# Altium project Logger.PrjPcb
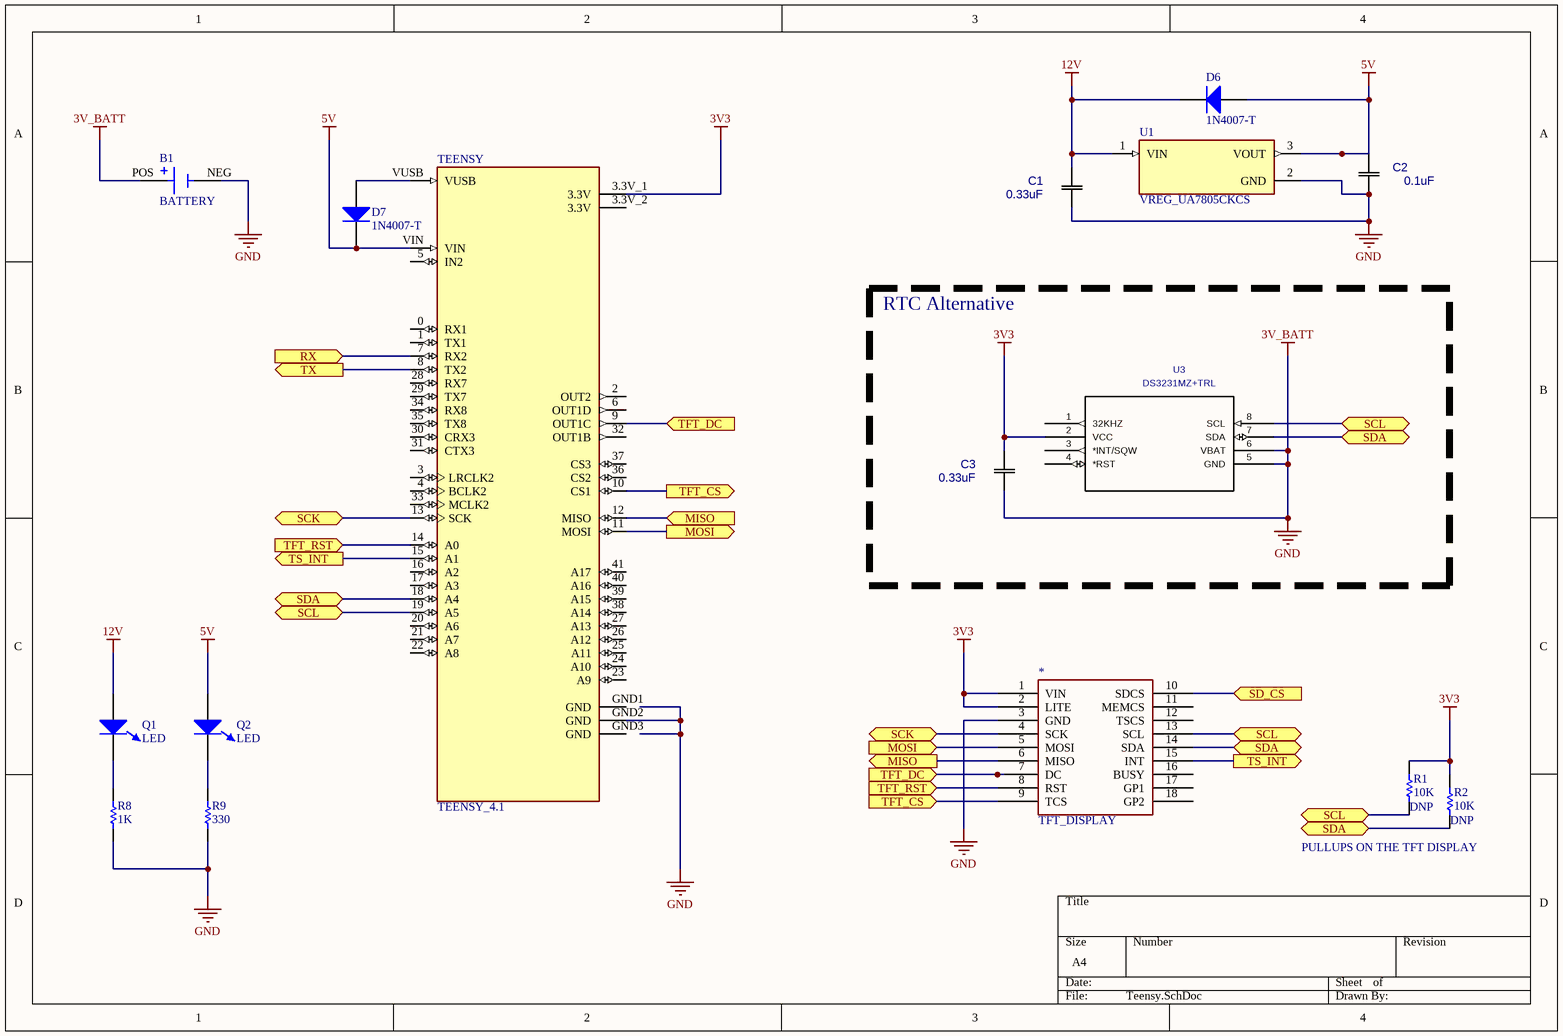
[diagram p0: Teensy.SchDoc]
3 sheets, 44 parts. Net scope: flat (ports and power ports of the same name join across sheets).
Sheets:
  Teensy.SchDoc
  LIN.SchDoc
  Pico.SchDoc

## Sheet Teensy.SchDoc
size A4

### Parts
(Parts that share a designator on the sheet are numbered #1, #2 ... from top to bottom, then left to right.)
*#1  TFT_DISPLAY
B1#1  BATTERY
C1#1  value 0.33uF  [CAP_TH_CER_5MM]  (hidden comment: CAP_TH_CER)
C2#1  value 0.1uF  [CAP_TH_CER_5MM]  (hidden comment: CAP_TH_CER)
C3#1  value 0.33uF  [CAP_TH_CER_5MM]  (hidden comment: CAP_TH_CER)
D6  1N4007-T
D7  1N4007-T
Q1#1  LED  [DIODE_0603]
Q2#1  LED  [DIODE_0603]
R1#1  10K  NOTE: DNP
R2#1  10K  NOTE: DNP
R8#1  1K
R9#1  330
TEENSY  TEENSY_4.1  [TEENSY_4.1]
U1#1  VREG_UA7805CKCS  [TO-220-3_7805]
U3#1  DS3231MZ+TRL  [8-SOIC-3.90MM]

### Blocks framed on the sheet
RTC Alternative: C3#1 U3#1

### Ports
MISO, MOSI, RX, SCK, SCL, SD_CS, SDA, TFT_CS, TFT_DC, TFT_RST, TS_INT, TX

### Nets
3V3: *#1.1(VIN) *#1.2(LITE) C3#1.2 R1#1.2 R2#1.2 TEENSY.3.3V_1(3.3V) U3#1.2(VCC)
3V_BATT: *#1.3(GND) B1#1.NEG B1#1.POS C1#1.1 C2#1.1 C3#1.1 R8#1.1 R9#1.1 TEENSY.GND2(GND) U1#1.2(GND) U3#1.5(GND) U3#1.6(VBAT)  [also labelled GND]
5V: C2#1.2 D6.1(A) D7.2(K) Q2#1.1(A) TEENSY.VIN U1#1.3(VOUT)
12V: C1#1.2 D6.2(K) Q1#1.1(A) U1#1.1(VIN)
MISO: *#1.6(MISO) TEENSY.12(MISO) ; port MISO
MOSI: *#1.5(MOSI) TEENSY.11(MOSI) ; port MOSI
RX: TEENSY.7(RX2) ; port RX
SCK: *#1.4(SCK) TEENSY.13(SCK) ; port SCK
SCL: *#1.13(SCL) R1#1.1 TEENSY.19(A5) U3#1.8(SCL) ; port SCL
SD_CS: *#1.10(SDCS) ; port SD_CS
SDA: *#1.14(SDA) R2#1.1 TEENSY.18(A4) U3#1.7(SDA) ; port SDA
TFT_CS: *#1.9(TCS) TEENSY.10(CS1) ; port TFT_CS
TFT_DC: *#1.7(DC) TEENSY.9(OUT1C) ; port TFT_DC
TFT_RST: *#1.8(RST) TEENSY.14(A0) ; port TFT_RST
TS_INT: *#1.15(INT) TEENSY.15(A1) ; port TS_INT
TX: TEENSY.8(TX2) ; port TX
NetD7_1: D7.1(A) TEENSY.VUSB
NetQ1#1_2: Q1#1.2(K) R8#1.2
NetQ2#1_2: Q2#1.2(K) R9#1.2

Not connected (* = marked no-connect by the designer): *#1 11(MEMCS) 12(TSCS) 16(BUSY) 17(GP1) 18(GP2); TEENSY 0(RX1) 1(TX1) 2(OUT2) 3(LRCLK2) 3.3V_2(3.3V) 4(BCLK2) 5(IN2) 6(OUT1D) 16(A2) 17(A3) 20(A6) 21(A7) 22(A8) 23(A9) 24(A10) 25(A11) 26(A12) 27(A13) 28(RX7) 29(TX7) 30(CRX3) 31(CTX3) 32(OUT1B) 33(MCLK2) 34(RX8) 35(TX8) 36(CS2) 37(CS3) 38(A14) 39(A15) 40(A16) 41(A17) GND1(GND) GND3(GND); U3#1 1(32KHZ) 3(*INT/SQW) 4(*RST)

### Notes on the sheet
- PULLUPS ON THE TFT DISPLAY

### Library data of the parts
*#1 = EYESPI_TFT_BREAKOUT
B1#1 = BATTERY: MPN: 1060TR
C1#1 C2#1 C3#1 = CAP_TH_CER: Mfr_Name: TDK
D6 D7 = DIODE
Q1#1 Q2#1 = DIODE_LED
R1#1 R2#1 R8#1 R9#1 = RES: Resistor; Value: ? Ohms; MPN: ?; SuppliersPartNumber: ?; Power: ?
TEENSY = TEENSY_4.1: TEENSY 4.1
U1#1 = VREG_UA7805CKCS: 1.5-A, 38-V, linear voltage regulator; Price: None; MP: UA7805CKCS; Value: *; Availability: Unavailable; Package: None
U3#1 = IC_RTC_DS3231MZ+TRL: Mfr_Name: Analog Devices Inc; Value: DS3231MZ+TRL; Manufacturer_Part_Number: DS3231MZ+TRL

## Sheet LIN.SchDoc
size A4
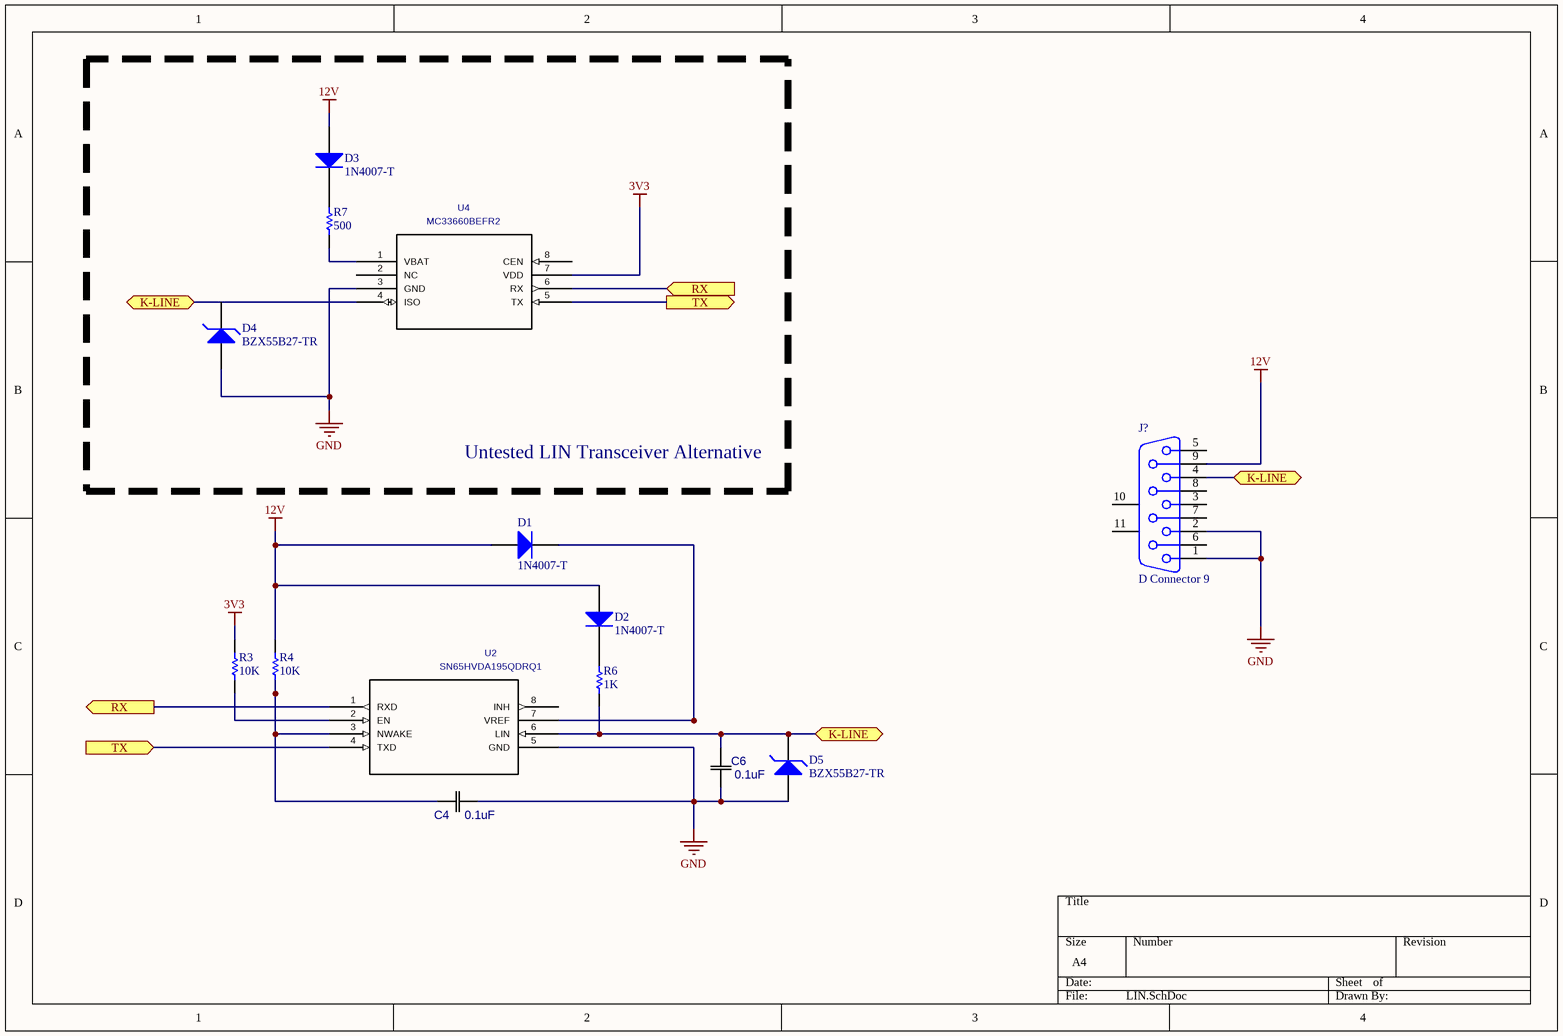
[diagram p1: LIN.SchDoc]

### Parts
C4  value 0.1uF  [CAP_TH_CER_5MM]  (hidden comment: CAP_TH_CER)
C6  value 0.1uF  [CAP_TH_CER_5MM]  (hidden comment: CAP_TH_CER)
D1  1N4007-T
D2  1N4007-T
D3  1N4007-T
D4  BZX55B27-TR
D5  BZX55B27-TR
J?  D Connector 9  [DSUB1.385-2H9]
R3  10K
R4  10K
R6  1K
R7  500
U2  SN65HVDA195QDRQ1  [8-Pin SOIC]
U4  MC33660BEFR2  [8-SOIC-3.90MM]

### Blocks framed on the sheet
Untested LIN Transceiver Alternative: D3 D4 R7 U4

### Ports
K-LINE, RX, TX

### Nets
3V3: R3.2 U4.7(VDD)
12V: D1.1(A) D2.1(A) D3.1(A) J?.9 R4.2
GND: C4.1 C6.1 D4.2(A) D5.2(A) J?.1 J?.2 U2.5(GND) U4.3(GND)  [project net 3V_BATT]
K-LINE: C6.2 D4.1(K) D5.1(K) J?.4 R6.1 U2.6(LIN) U4.4(ISO) ; port K-LINE
RX: U2.1(RXD) U4.6(RX) ; port RX
TX: U2.4(TXD) U4.5(TX) ; port TX
NetC4_2: C4.2 R4.1 U2.3(NWAKE)
NetD1_2: D1.2(K) U2.7(VREF)
NetD2_2: D2.2(K) R6.2
NetD3_2: D3.2(K) R7.2
NetR3_1: R3.1 U2.2(EN)
NetR7_1: R7.1 U4.1(VBAT)

Not connected (* = marked no-connect by the designer): J? 3 5 6 7 8 10(MH1) 11(MH2); U2 8(INH); U4 2(NC) 8(CEN)

### Library data of the parts
C4 C6 = CAP_TH_CER: Mfr_Name: TDK
D1-D3 = DIODE
D4 D5 = DIODE_ZENER: Zener Diode; MPN: ?
J? = D Connector 9: Receptacle Assembly, 9 Position, Right Angle; PackageDocument: O; Positions: 9; Published: 15-Jun-2001; LatestRevisionDate: 17-Jul-2002; LatestRevisionNote: Re-released for DXP Platform.; DatasheetDocument: 1-Sep-1999; PackageReference: 788750; Publisher: Altium Limited; Orientation: Right Angle; Gender: Receptacle
R3 R4 R6 R7 = RES: Resistor; Value: ? Ohms; MPN: ?; SuppliersPartNumber: ?; Power: ?
U2 = IC_LIN_SN65HVDA195QDRQ1: Mfr_Name: Texas Instruments; Value: SN65HVDA195QDRQ1; Manufacturer_Part_Number: SN65HVDA195QDRQ1
U4 = IC_LIN_MC33660BEFR2: Mfr_Name: NXP; Value: MC33660BEFR2; Manufacturer_Part_Number: MC33660BEFR2

## Sheet Pico.SchDoc
size A4
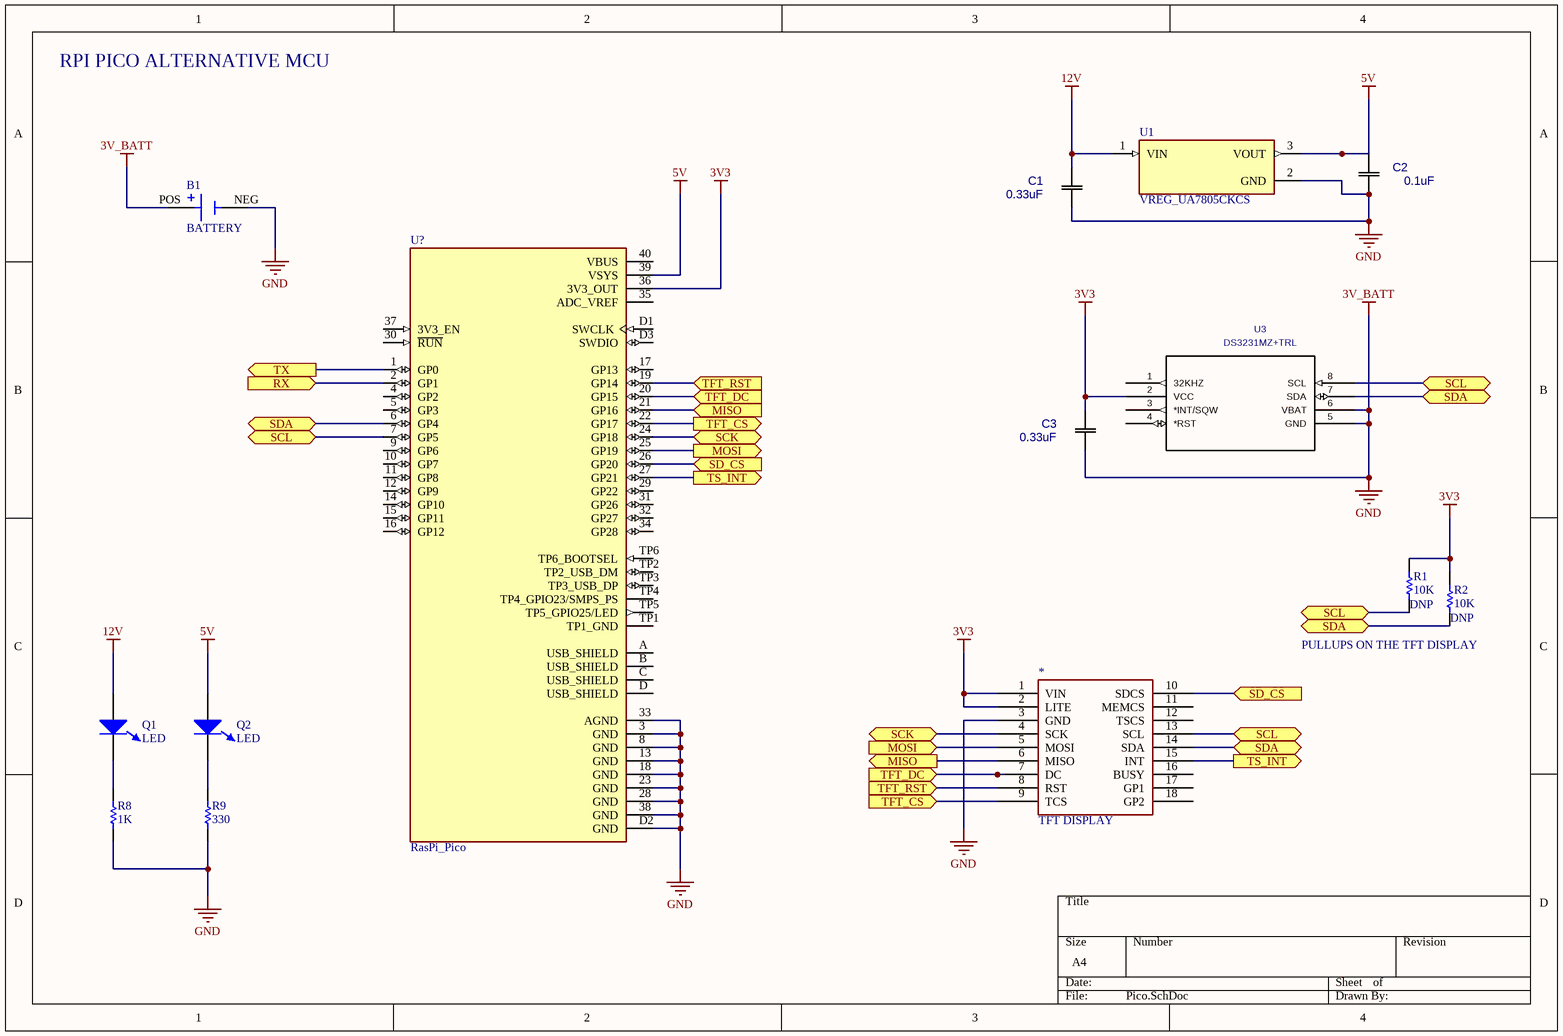
[diagram p2: Pico.SchDoc]

### Parts
(Parts that share a designator on the sheet are numbered #1, #2 ... from top to bottom, then left to right.)
*#2  TFT DISPLAY
B1#2  BATTERY
C1#2  value 0.33uF  [CAP_TH_CER_5MM]  (hidden comment: CAP_TH_CER)
C2#2  value 0.1uF  [CAP_TH_CER_5MM]  (hidden comment: CAP_TH_CER)
C3#2  value 0.33uF  [CAP_TH_CER_5MM]  (hidden comment: CAP_TH_CER)
Q1#2  LED  [DIODE_0603]
Q2#2  LED  [DIODE_0603]
R1#2  10K  NOTE: DNP
R2#2  10K  NOTE: DNP
R8#2  1K
R9#2  330
U1#2  VREG_UA7805CKCS  [TO-220-3_7805]
U3#2  DS3231MZ+TRL  [8-SOIC-3.90MM]
U?  RasPi_Pico  [RasPi_Pico]

### Ports
MISO, MOSI, RX, SCK, SCL, SD_CS, SDA, TFT_CS, TFT_DC, TFT_RST, TS_INT, TX

### Nets
3V3: *#2.1(VIN) *#2.2(LITE) C3#2.2 R1#2.2 R2#2.2 U3#2.2(VCC) U?.36(3V3_OUT)
3V_BATT: *#2.3(GND) B1#2.NEG B1#2.POS C1#2.1 C2#2.1 C3#2.1 R8#2.1 R9#2.1 U1#2.2(GND) U3#2.5(GND) U3#2.6(VBAT) U?.3(GND) U?.8(GND) U?.13(GND) U?.18(GND) U?.23(GND) U?.28(GND) U?.33(AGND) U?.38(GND) U?.D2(GND)  [also labelled GND]
5V: C2#2.2 Q2#2.1(A) U1#2.3(VOUT) U?.39(VSYS)
12V: C1#2.2 Q1#2.1(A) U1#2.1(VIN)
MISO: *#2.6(MISO) U?.21(GP16) ; port MISO
MOSI: *#2.5(MOSI) U?.25(GP19) ; port MOSI
RX: U?.2(GP1) ; port RX
SCK: *#2.4(SCK) U?.24(GP18) ; port SCK
SCL: *#2.13(SCL) R1#2.1 U3#2.8(SCL) U?.7(GP5) ; port SCL
SD_CS: *#2.10(SDCS) U?.26(GP20) ; port SD_CS
SDA: *#2.14(SDA) R2#2.1 U3#2.7(SDA) U?.6(GP4) ; port SDA
TFT_CS: *#2.9(TCS) U?.22(GP17) ; port TFT_CS
TFT_DC: *#2.7(DC) U?.20(GP15) ; port TFT_DC
TFT_RST: *#2.8(RST) U?.19(GP14) ; port TFT_RST
TS_INT: *#2.15(INT) U?.27(GP21) ; port TS_INT
TX: U?.1(GP0) ; port TX
NetQ1#2_2: Q1#2.2(K) R8#2.2
NetQ2#2_2: Q2#2.2(K) R9#2.2

Not connected (* = marked no-connect by the designer): *#2 11(MEMCS) 12(TSCS) 16(BUSY) 17(GP1) 18(GP2); U3#2 1(32KHZ) 3(*INT/SQW) 4(*RST); U? 4(GP2) 5(GP3) 9(GP6) 10(GP7) 11(GP8) 12(GP9) 14(GP10) 15(GP11) 16(GP12) 17(GP13) 29(GP22) 30(~{RUN}) 31(GP26) 32(GP27) 34(GP28) 35(ADC_VREF) 37(3V3_EN) 40(VBUS) A(USB_SHIELD) B(USB_SHIELD) C(USB_SHIELD) D(USB_SHIELD) D1(SWCLK) D3(SWDIO) TP1(TP1_GND) TP2(TP2_USB_DM) TP3(TP3_USB_DP) TP4(TP4_GPIO23/SMPS_PS) TP5(TP5_GPIO25/LED) TP6(TP6_BOOTSEL)

### Notes on the sheet
- RPI PICO ALTERNATIVE MCU
- PULLUPS ON THE TFT DISPLAY

### Library data of the parts
*#2 = EYESPI_TFT_BREAKOUT
B1#2 = BATTERY: MPN: 1060TR
C1#2 C2#2 C3#2 = CAP_TH_CER: Mfr_Name: TDK
Q1#2 Q2#2 = DIODE_LED
R1#2 R2#2 R8#2 R9#2 = RES: Resistor; Value: ? Ohms; MPN: ?; SuppliersPartNumber: ?; Power: ?
U1#2 = VREG_UA7805CKCS: 1.5-A, 38-V, linear voltage regulator; Price: None; MP: UA7805CKCS; Value: *; Availability: Unavailable; Package: None
U3#2 = IC_RTC_DS3231MZ+TRL: Mfr_Name: Analog Devices Inc; Value: DS3231MZ+TRL; Manufacturer_Part_Number: DS3231MZ+TRL
U? = RasPi_Pico: RP2040 Raspberry Pi Pico series ARMÂ® CortexÂ®-M0+ MCU 32-Bit Embedded Evaluation Board; MP: SC0915; MF: Raspberry Pi

## Nets that join several sheets
3V3: Teensy (7 pins), LIN (R3.2 U4.7), Pico (7 pins)
3V_BATT: Teensy (12 pins), LIN (8 pins), Pico (20 pins)
5V: Teensy (6 pins), Pico (C2#2.2 Q2#2.1 U1#2.3 U?.39)
12V: Teensy (C1#1.2 D6.2 Q1#1.1 U1#1.1), LIN (5 pins), Pico (C1#2.2 Q1#2.1 U1#2.1)
MISO: Teensy (*#1.6 TEENSY.12), Pico (*#2.6 U?.21)
MOSI: Teensy (*#1.5 TEENSY.11), Pico (*#2.5 U?.25)
RX: Teensy (TEENSY.7), LIN (U2.1 U4.6), Pico (U?.2)
SCK: Teensy (*#1.4 TEENSY.13), Pico (*#2.4 U?.24)
SCL: Teensy (*#1.13 R1#1.1 TEENSY.19 U3#1.8), Pico (*#2.13 R1#2.1 U3#2.8 U?.7)
SD_CS: Teensy (*#1.10), Pico (*#2.10 U?.26)
SDA: Teensy (*#1.14 R2#1.1 TEENSY.18 U3#1.7), Pico (*#2.14 R2#2.1 U3#2.7 U?.6)
TFT_CS: Teensy (*#1.9 TEENSY.10), Pico (*#2.9 U?.22)
TFT_DC: Teensy (*#1.7 TEENSY.9), Pico (*#2.7 U?.20)
TFT_RST: Teensy (*#1.8 TEENSY.14), Pico (*#2.8 U?.19)
TS_INT: Teensy (*#1.15 TEENSY.15), Pico (*#2.15 U?.27)
TX: Teensy (TEENSY.8), LIN (U2.4 U4.5), Pico (U?.1)